# EAGLE design PiezoDriver v2 (EAGLE 9.6.2)
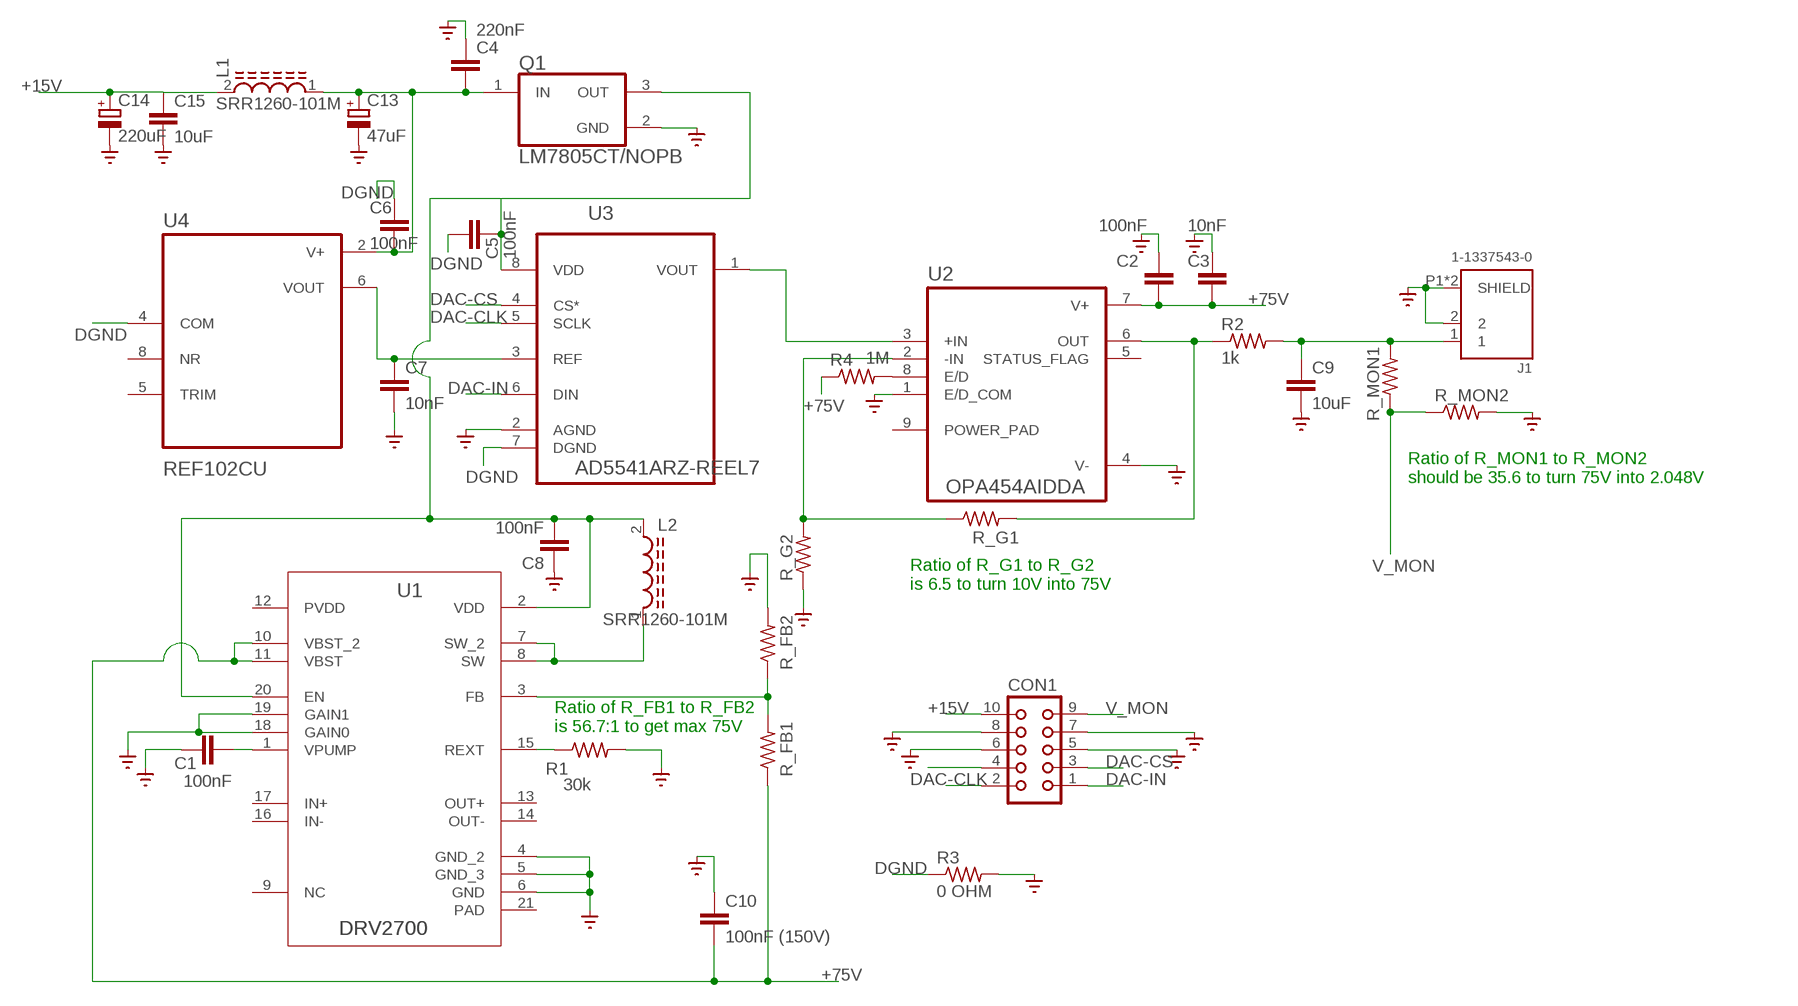
[diagram p0: schematic, sheet 1]

## Parts
C1  100nF  C-EUC1206  [C1206]
C2  100nF  C-EUC1206  [C1206]
C3  10nF  C-EUC1206  [C1206]
C4  220nF  C-EUC1206  [C1206]
C5  100nF  C-EUC1206  [C1206]
C6  100nF  C-EUC1206  [C1206]
C7  10nF  C-EUC1206  [C1206]
C8  100nF  C-EUC1206  [C1206]
C9  10uF  C-EUC1206  [C1206]
C10  100nF (150V)  C-EUC1206  [C1206]
C13  47uF  CPOL-EU175TMP-0808  [175TMP-0808]
C14  220uF  CPOL-EUE3.5-8  [E3,5-8]
C15  10uF  C-EUC1206  [C1206]
CON1  CON10  [CON10]
J1  1-1337543-0  [CONN_1-1337543-0]
L1  SRR1260-101M  [INDP125125X600N]
L2  SRR1260-101M  [INDP125125X600N]
Q1  LM7805CT/NOPB  [TO254P1054X470X2600-3]
R1  30k  R-US_R1206  [R1206]
R2  1k  R-US_R1206  [R1206]
R3  0 OHM  R-US_R1206  [R1206]
R4  1M  R-US_R1206  [R1206]
R_FB1  R-US_R1206  [R1206]
R_FB2  R-US_R1206  [R1206]
R_G1  R-US_R1206  [R1206]
R_G2  R-US_R1206  [R1206]
R_MON1  R-US_R1206  [R1206]
R_MON2  R-US_R1206  [R1206]
U1  DRV2700  DRV2700RGPT  [RGP0020D]
U2  OPA454AIDDA  [VREG_LM5017MR/NOPB]
U3  AD5541ARZ-REEL7  [SOIC127P600X175-8N]
U4  REF102CU  [SOIC127P599X175-8N]

## Nets
+15V: C14.+ C15.1 CON1.10 L1.2
+75V: C2.2 C3.2 C10.2 R4.1 R_FB1.1 U1.10(VBST_2) U1.11(VBST) U2.7(V+)
DAC-CLK: CON1.2 U3.5(SCLK)
DAC-CS: CON1.3 U3.4(CS*)
DAC-IN: CON1.1 U3.6(DIN)
DGND: C5.1 C6.1 R3.1 U3.7(DGND) U4.4(COM)
GND: C1.1 C2.1 C3.1 C4.1 C7.2 C8.1 C9.2 C10.1 C13.- C14.- C15.2 CON1.5 CON1.6 CON1.7 CON1.8 J1.2 J1.P1(SHIELD) J1.P2(SHIELD) Q1.2(GND) R1.2 R3.2 R_FB2.2 R_G2.1 R_MON2.2 U1.4(GND_2) U1.5(GND_3) U1.6(GND) U1.18(GAIN0) U1.19(GAIN1) U2.1(E/D_COM) U2.4(V-) U3.2(AGND) ; supply symbol labelled SUPPLY0_GND_
N$1: U2.3(+IN) U3.1(VOUT)
N$2: R_G1.1 R_G2.2 U2.2(-IN)
N$3: C1.2 U1.1(VPUMP)
N$4: C7.1 U3.3(REF) U4.6(VOUT)
N$5: R1.1 U1.15(REXT)
N$6: C9.1 J1.1 R2.2 R_MON1.2
N$7: L2.1 U1.7(SW_2) U1.8(SW)
N$8: R4.2 U2.8(E/D)
N$9: R_FB1.2 R_FB2.1 U1.3(FB)
N$11: C5.2 C8.2 L2.2 Q1.3(OUT) U1.2(VDD) U1.20(EN) U3.8(VDD)
N$12: R2.1 R_G1.2 U2.6(OUT)
N$14: C4.2 C6.2 C13.+ L1.1 Q1.1(IN) U4.2(V+)
N$15: CON1.4
V_MON: CON1.9 R_MON1.1 R_MON2.1
Unconnected: U1.9(NC) U1.13(OUT+) U1.14(OUT-) U1.16(IN-) U1.17(IN+) U2.5(STATUS_FLAG) U2.9(POWER_PAD) U4.5(TRIM) U4.8(NR)

## Notes on the sheet
- Ratio of R_MON1 to R_MON2
  should be 35.6 to turn 75V into 2.048V
- Ratio of R_G1 to R_G2 
  is 6.5 to turn 10V into 75V
- Ratio of R_FB1 to R_FB2 
  is 56.7:1 to get max 75V

## Power pins joined to a net without a drawn wire
PAD: U1.21(PAD)
PVDD: U1.12(PVDD)

## Library data of the parts
C1-C10 C15 = rcl:C-EU: CAPACITOR, European symbol; SPICEPREFIX: C
C13 C14 = rcl:CPOL-EU: POLARIZED CAPACITOR, European symbol; SPICEPREFIX: C
CON1 = con-harting:CON10: CONNECTOR; OC_FARNELL: unknown; OC_NEWARK: unknown
J1 = 1-1337543-0:1-1337543-0: BNC appliance socket, right angle [TE Connectivity] 1-1337543-0 BNC appliance socket, right angle; DESCRIPTION: BNC Connector Jack, Female Socket 50Ohm Panel Mount, Through Hole, Right Angle Solder; DIGI-KEY_PART_NUMBER: A97553-ND; MF: TE Connectivity; MP: 113375430; PACKAGE: None
L1 L2 = SRR1260-101M:SRR1260-101M: Inductor Power Shielded Wirewound 33uH 20% 100KHz 27Q-Factor Ferrite 3A 60mOhm DCR T/R Check prices <https://pricing.snapeda.com/parts/SRR1260-101M/Bourns/view-part?ref=eda>; AVAILABILITY: Good; DESCRIPTION: 100µH Shielded Wirewound Inductor 1.7A 180mOhm Max Nonstandard; MF: Bourns; MP: SRR1260-101M; PACKAGE: Nonstandard Bourns; PRICE: None; PURCHASE-URL: https://pricing.snapeda.com/search/part/SRR1260-101M/?ref=eda
Q1 = LM7805CT_NOPB:LM7805CT/NOPB: Standard Regulator Pos 5V 1A 3-Pin(3+Tab) TO-220 Rail Check prices <https://pricing.snapeda.com/parts/LM7805CT/ON%20Semiconductor/view-part?ref=eda>; AVAILABILITY: Warning; DESCRIPTION: Linear Voltage Regulator IC Positive Fixed 1 Output 1A TO-220-3; MF: ON Semiconductor; MP: LM7805CT; PACKAGE: TO-220-3 ON Semiconductor; PRICE: None; PURCHASE-URL: https://pricing.snapeda.com/search/part/LM7805CT/?ref=eda
R1-R4 R_FB1 R_FB2 R_G1 R_G2 R_MON1 R_MON2 = rcl:R-US_: RESISTOR, American symbol; SPICEPREFIX: R
U1 = DRV2700:DRV2700RGPT: DRV2700 TEXAS INSTRUMENTS HV PIEZO DRIVER; ALTERNATE_PARTNUMBER: DRV2700RGPT; COMPTYPE: IC; MANUFACTURER: Texas Instruments; MOUNTTYPE: SMT; PACKAGEREFERENCE: RGP0020D; PARTNUMBER: DRV2700RGPR; PIN_COUNT: 21; REFDES: RefDes; ROHS: Y; TYPE: TYPE; VALUE: Value
U2 = OPA454AIDDA:OPA454AIDDA: Check prices <https://pricing.snapeda.com/parts/OPA454AIDDA/Texas%20Instruments/view-part?ref=eda>; AVAILABILITY: In Stock; DESCRIPTION: High Voltage (100V), High-Current (50mA) Operational Amplifiers, G=1 Stable 8-SO PowerPAD -55 to 125; MF: Texas Instruments; MP: OPA454AIDDA; PACKAGE: HSOIC-8 Texas Instruments; PRICE: None; PURCHASE-URL: https://pricing.snapeda.com/search/part/OPA454AIDDA/?ref=eda
U3 = AD5541ARZ-REEL7:AD5541ARZ-REEL7: 16-Bit Digital-to-Analog Converters Check prices <https://pricing.snapeda.com/parts/AD5541ARZ/Analog%20Devices/view-part?ref=eda>; AVAILABILITY: Warning; DESCRIPTION: 16 Bit Digital to Analog Converter 1 8-SOIC; MF: Analog Devices; MP: AD5541ARZ; PACKAGE: SOIC-8 Analog Devices; PRICE: None; PURCHASE-URL: https://pricing.snapeda.com/search/part/AD5541ARZ/?ref=eda
U4 = REF102CU:REF102CU; AVAILABILITY: Unavailable; DESCRIPTION: 2.5-ppm/C drift, 10-V precision voltage reference 8-SOIC -25 to 85; MF: Texas Instruments; MP: REF102CU; PACKAGE: SOIC-8 Texas Instruments; PRICE: None; PURCHASE-URL: https://pricing.snapeda.com/search/part/REF102CU/?ref=eda

## Net classes
0 default: width 0.14 mm

## Board
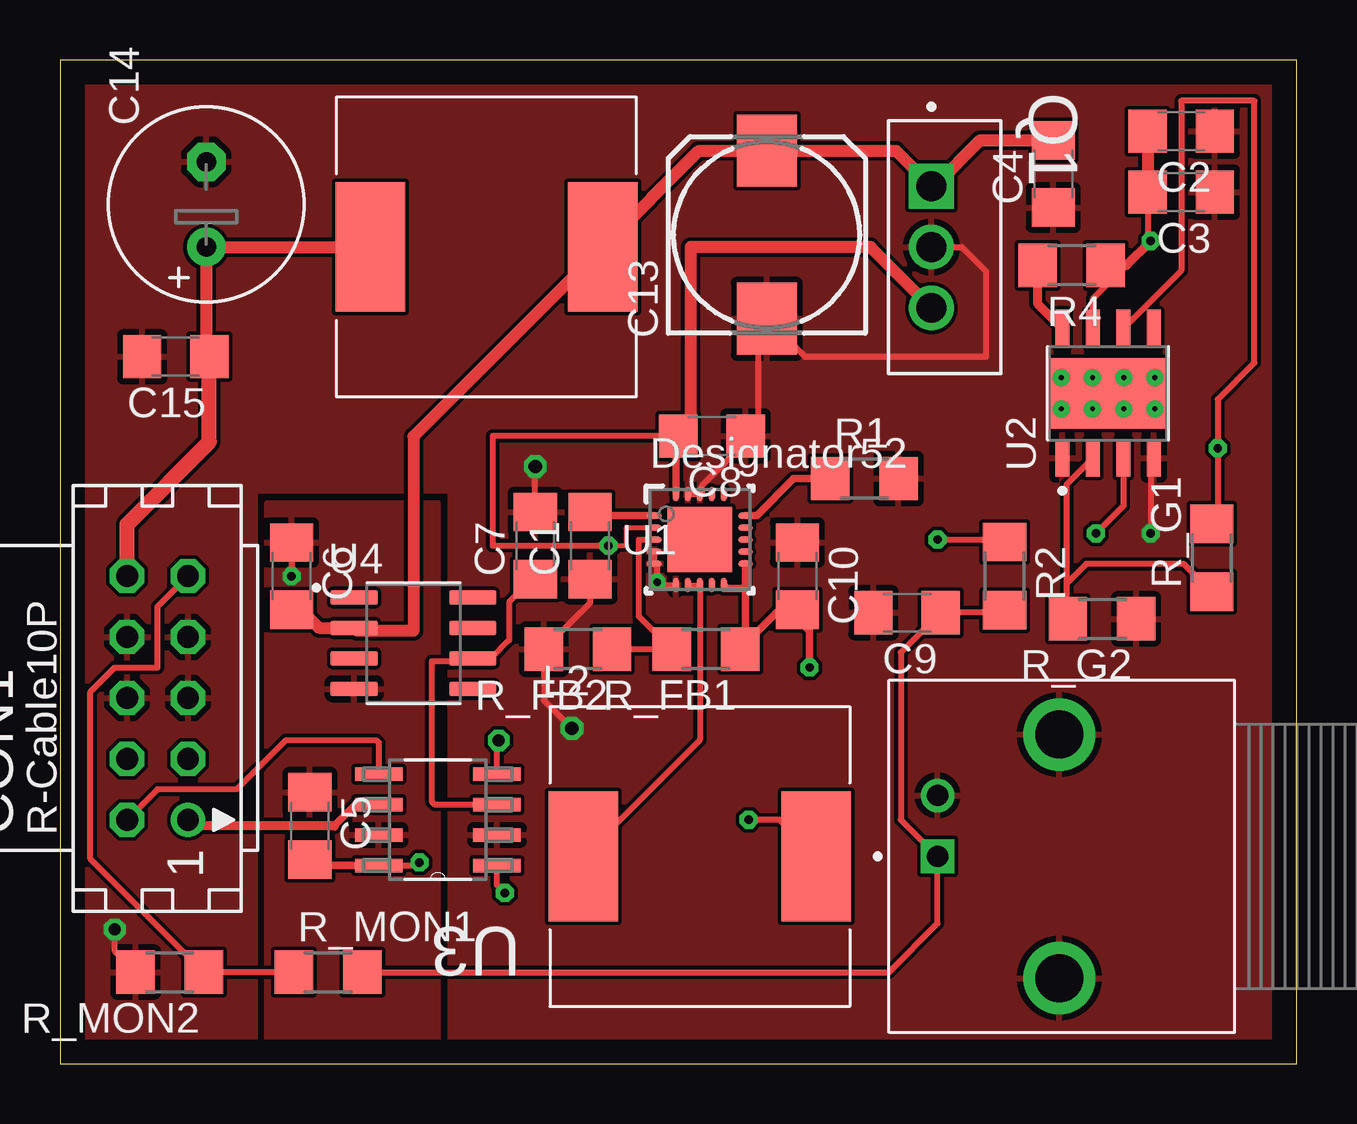
[diagram p1: board, top side]
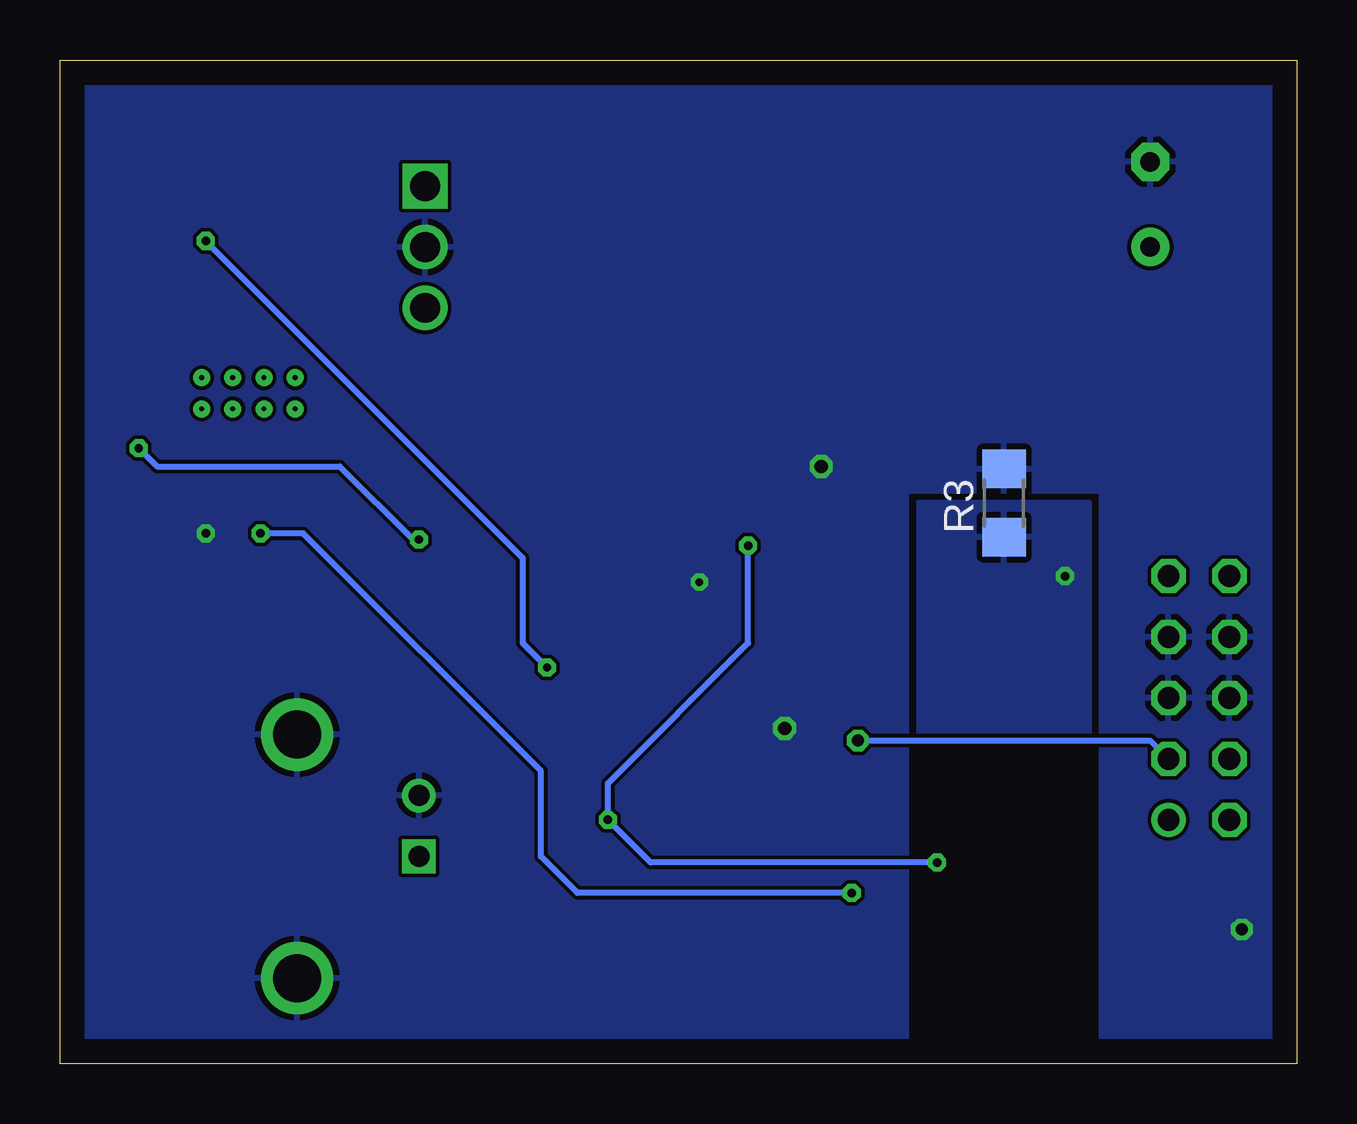
[diagram p2: board, bottom side, seen from below]

Size 51.54 x 41.83 mm. Coordinates in mm from the lower left corner, seen from the top.
Outline: 0,0 51.54,0 51.54,41.83 0,41.83 0,0
Copper layers (1*16): Top 0.035mm / dielectric 1.5mm / Bottom 0.035mm
Design rules "default": minimum track width 6mil, minimum drill 0.35mm, track to track 6mil, track to pad 6mil, pad to pad 6mil, via to via 6mil, smd to smd 6mil, copper to edge 40mil, drill to drill 6mil, minimum pad ring 10mil, minimum via ring 8mil, stop-mask expansion 4mil, vias tented up to drill 0mil, thermal gap 10mil

### Footprints (pad centres in the part's own frame; a part is rotated, then mirrored left to right if it is on the bottom)
C1206 = smd 1.6 x 1.8: 1 -1.4,0; 2 1.4,0
175TMP-0808 = smd 3 x 2.5: + 3.5,0; - -3.5,0
E3,5-8 = drill 0.813 pad 1.6: + -1.778,0 | drill 0.813 pad 1.6 octagon: - 1.778,0
CON10 = drill 0.914: 1 -5.08,-1.27 | drill 0.914 octagon: 2 -5.08,1.27; 3 -2.54,-1.27; 4 -2.54,1.27; 5 0,-1.27; 6 0,1.27; 7 2.54,-1.27; 8 2.54,1.27; 9 5.08,-1.27; 10 5.08,1.27
CONN_1-1337543-0 = drill 0.89 square: 1 0,0 | drill 0.89: 2 0,-2.54 | drill 2.01: P1 -5.08,-5.08; P2 -5.08,5.08
INDP125125X600N = smd 2.9 x 5.4: 1 -4.85,0; 2 4.85,0
TO254P1054X470X2600-3 = drill 1.24 square: 1 0,0 | drill 1.24: 2 2.54,0; 3 5.08,0
R1206 = smd 1.6 x 1.803: 1 -1.422,0; 2 1.422,0
RGP0020D = smd 0.6 x 0.24: 1 -1.9,1; 2 -1.9,0.5; 3 -1.9,0; 4 -1.9,-0.5; 5 -1.9,-1; 11 1.9,-1; 12 1.9,-0.5; 13 1.9,0; 14 1.9,0.5; 15 1.9,1 | smd 0.24 x 0.6: 6 -1,-1.9; 7 -0.5,-1.9; 8 0,-1.9; 9 0.5,-1.9; 10 1,-1.9; 16 1,1.9; 17 0.5,1.9; 18 0,1.9; 19 -0.5,1.9; 20 -1,1.9 | smd 2.7 x 2.7: 21 0,0 | smd 0.5 x 0.5: V 0,1.1
VREG_LM5017MR/NOPB = smd 1.55 x 0.6: 1 -2.7,1.905; 2 -2.7,0.635; 3 -2.7,-0.635; 4 -2.7,-1.905; 5 2.7,-1.905; 6 2.7,-0.635; 7 2.7,0.635; 8 2.7,1.905 | smd 2.95 x 4.9: 9 0,0 | drill 0.2 pad 0.3: 10 -0.65,1.95; 11 0.65,1.95; 12 -0.65,0.65; 13 0.65,0.65; 14 -0.65,-0.65; 15 0.65,-0.65; 16 -0.65,-1.95; 17 0.65,-1.95
SOIC127P600X175-8N = smd 1.981 x 0.559: 1 -2.464,1.905; 2 -2.464,0.635; 3 -2.464,-0.635; 4 -2.464,-1.905; 5 2.464,-1.905; 6 2.464,-0.635; 7 2.464,0.635; 8 2.464,1.905
SOIC127P599X175-8N = smd 1.97 x 0.6: 1 -2.47,1.905; 2 -2.47,0.635; 3 -2.47,-0.635; 4 -2.47,-1.905; 5 2.47,-1.905; 6 2.47,-0.635; 7 2.47,0.635; 8 2.47,1.905

### Placement (x,y rotation side)
C1  22.1,21.59 90 top
C2  46.74,38.86 180 top
C3  46.74,36.32 180 top
C4  41.4,37.08 90 top
C5  10.41,9.91 270 top
C6  9.65,20.32 270 top
C7  19.81,21.59 90 top
C8  27.18,26.16 180 top
C9  35.31,18.8 180 top
C10  30.73,20.32 270 top
C13  29.46,34.54 90 top
C14  6.1,35.81 90 top
C15  4.83,29.46 180 top
CON1  4.06,15.24 90 top
J1  36.58,8.64 180 top
L1  17.78,34.04 180 top
L2  26.67,8.64 0 top
Q1  36.32,36.58 270 top
R1  33.53,24.38 0 top
R2  39.37,20.32 270 top
R3  12.19,23.37 90 bottom
R4  42.16,33.27 180 top
R_FB1  26.92,17.27 180 top
R_FB2  21.59,17.27 180 top
R_G1  48.01,21.08 90 top
R_G2  43.43,18.54 180 top
R_MON1  11.18,3.81 0 top
R_MON2  4.57,3.81 180 top
U1  26.67,21.84 0 top
U2  43.69,27.94 90 top
U3  15.75,10.16 180 top
U4  14.73,17.53 0 top

### Tracks (layer width: path | path; a pad name or v marks a point on that pad's centre or on a via)
+15V
  Top 0.508: C15.1 6.1,29.59 C14.+ L1.2
  Top 0.635: CON1.10 2.79,22.48 6.23,25.91 C15.1
+75V  (via drill 0.35)
  Top 0.254: 44.83,35.82 C3.2 45.34,34.42 v45.47,34.29 43.05,31.88 U2.7
  Top 0.305: U1.11 28.57,19.93 | 28.57,19.93 28.45,19.81 27.8,19.81 U1.10 | 28.57,19.93 28.57,17.5 R_FB1.1 29.99,18.92 C10.2 30.73,18.54 31.24,18.03 v31.24,16.51
  Top 0.381: v45.47,34.29 44.45,33.27 R4.1
  Top 0.508: C2.2 C3.2
  Bottom 0.254: v31.24,16.51 32.26,17.53 32.26,21.08 v45.47,34.29
DAC-CLK
  Top 0.254: U3.5 13.28,13.39 13.21,13.46 9.4,13.46 7.37,11.43 4.06,11.43 CON1.2
DAC-CS  (via drill 0.5)
  Top 0.254: U3.4 18.21,13.39 v18.29,13.46
  Bottom 0.254: CON1.3 6.1,13.46 v18.29,13.46
DAC-IN
  Top 0.305: U3.6 12.32,10.79 11.43,9.91
  Top 0.381: 11.43,9.91 5.59,9.91 CON1.1
DGND  (via drill 0.35)
  Top 0.254: C6.1 v9.65,20.32
  pour Bottom: 8.64,23.37 15.75,23.37 15.75,0.25 8.64,0.25
  pour Top: 8.64,23.37 15.75,23.37 15.75,0.25 8.64,0.25
GND  (via drill 0.3, 0.35, 0.5, 0.55)
  Top 0.254: R_MON2.2 2.29,4.67 v2.29,5.59 | C1.1 22.1,19.2 R_FB2.2 20.17,15.14 v21.34,13.97 | C7.2 v19.81,24.89 | U1.4 U1.5 24.89,20.72 v24.89,20.07 25.01,19.94 U1.6 | U1.19 U1.18 26.77,23.85 26.77,24.09 28.58,25.9 C8.1 29.09,26.67 29.09,30.67 C13.- 31.04,29.46 38.61,29.46 38.61,33.02 37.59,34.04 Q1.2 | U2.4 45.47,25.11 v45.47,22.1
  pour Bottom: 0,41.66 51.31,41.66 51.31,0.25 16.26,0.25 16.26,23.88 8.13,23.88 8.13,0.25 0,0.25
  pour Top: 0,0.25 8.13,0.25 8.13,23.88 16.26,23.88 16.26,0.25 51.56,0.25 51.56,41.66 0,41.66
N$1  (via drill 0.35)
  Top 0.254: v43.18,22.1 44.32,23.24 U2.3 | v18.54,7.11 18.21,7.44 U3.1
  Bottom 0.254: v18.54,7.11 29.97,7.11 31.5,8.64 31.5,12.19 41.4,22.1 v43.18,22.1
N$2
  Top 0.254: R_G1.1 46.84,20.83 42.77,20.83 41.96,20.01 | R_G2.2 41.96,18.59 41.96,20.01 | 41.96,20.01 41.96,24.15 U2.2
N$3
  Top 0.305: C1.2 22.24,22.84 U1.1
N$4
  Top 0.254: C7.1 19.68,20.19 18.73,19.23 18.73,17.65 17.96,16.89 U4.6 17.07,16.76 15.49,16.76 15.49,10.92 15.62,10.79 U3.3
N$5
  Top 0.305: U1.15 29.04,22.84 30.58,24.38 R1.1
N$6
  Top 0.254: R_MON1.2 34.54,3.81 36.58,5.84 J1.1 35.05,10.16 35.05,17.14 C9.1 39.27,18.8 R2.2
N$7
  Top 0.203: U1.7 U1.8
  Top 0.254: U1.8 26.67,13.49 L2.1
N$8
  Top 0.381: R4.2 40.74,31.68 U2.8
N$9
  Top 0.254: R_FB2.1 R_FB1.2 24.13,18.64 24.13,21.84 U1.3
N$11  (via drill 0.35)
  Top 0.203: v22.86,21.59 23.62,21.59 23.62,22.35 24.76,22.35 U1.2
  Top 0.254: L2.2 30,10.16 v28.7,10.16 | C8.2 18.03,26.16 18.03,21.59 v22.86,21.59 | U3.8 14.86,8.25 v14.99,8.38
  Top 0.305: C8.2 25.67,26.05 U1.20 | C5.2 10.66,8.25 U3.8
  Top 0.508: Q1.3 33.78,34.04 26.29,34.04 26.29,26.67 C8.2
  Bottom 0.254: v22.86,21.59 22.86,17.53 28.7,11.68 v28.7,10.16 26.92,8.38 v14.99,8.38
N$12  (via drill 0.35)
  Top 0.254: R_G1.2 48.26,22.76 v48.26,25.65 48.26,27.69 49.78,29.21 49.78,40.13 46.74,40.13 46.74,33.05 U2.6 | v36.58,21.84 39.27,21.84 R2.1
  Bottom 0.254: v48.26,25.65 47.5,24.89 39.88,24.89 36.83,21.84 v36.58,21.84
N$14
  Top 0.508: C4.2 38.35,38.48 36.45,36.58 Q1.1 34.85,38.04 C13.+ 26.64,38.04 L1.1 14.73,26.14 14.73,18.03 12.39,18.03 U4.2 10.8,18.16 10.04,18.92 C6.2
V_MON
  Top 0.254: R_MON1.1 R_MON2.1 1.27,8.53 1.27,15.49 2.29,16.51 4.06,16.51 4.06,19.05 CON1.9